# Altium schematic sheet Motor.schdoc
size A4
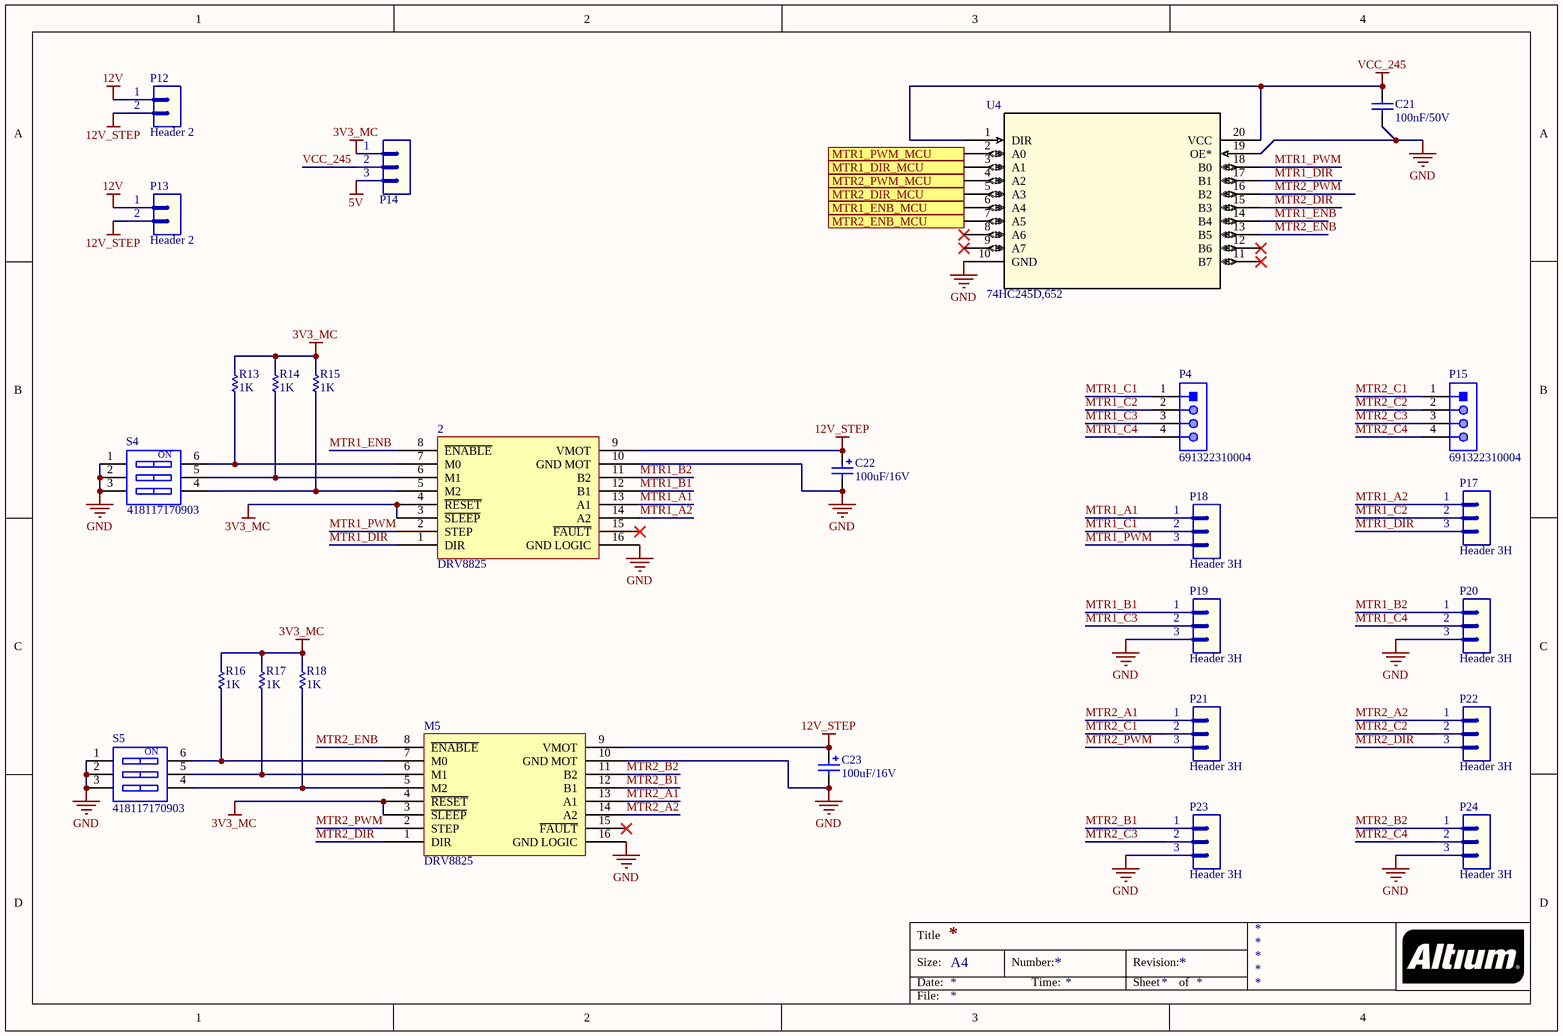
[diagram p0: Motor.schdoc]

## Parts
2  DRV8825  [PCBComponent_1]
C21  value 100nF/50V  [CAP-SM-0805]  (hidden comment: Cap-100nF-50V-0805)
C22  value 100uF/16V  [CAP-SM-AL-SIZE-D-D6L6]  (hidden comment: Cap-Al-100uF-16V-D6L5)
C23  value 100uF/16V  [CAP-SM-AL-SIZE-D-D6L6]  (hidden comment: Cap-Al-100uF-16V-D6L5)
M5  DRV8825  [PCBComponent_1]
P4  691322310004  [691322310004]
P12  Header 2  [JP2]
P13  Header 2  [JP2]
P14  Header 3  [JP3]  (value not drawn)
P15  691322310004  [691322310004]
P17  Header 3H  [JP3H]
P18  Header 3H  [JP3H]
P19  Header 3H  [JP3H]
P20  Header 3H  [JP3H]
P21  Header 3H  [JP3H]
P22  Header 3H  [JP3H]
P23  Header 3H  [JP3H]
P24  Header 3H  [JP3H]
R13  value 1K  [RES-SM-0805]  (hidden comment: Resistor 1/4W)
R14  value 1K  [RES-SM-0805]  (hidden comment: Resistor 1/4W)
R15  value 1K  [RES-SM-0805]  (hidden comment: Resistor 1/4W)
R16  value 1K  [RES-SM-0805]  (hidden comment: Resistor 1/4W)
R17  value 1K  [RES-SM-0805]  (hidden comment: Resistor 1/4W)
R18  value 1K  [RES-SM-0805]  (hidden comment: Resistor 1/4W)
S4  418117170903  [PCBComponent_1]
S5  418117170903  [PCBComponent_1]
U4  74HC245D,652  [SOT163-1_NEX]

## Ports
MTR1_DIR_MCU (in), MTR1_ENB_MCU (in), MTR1_PWM_MCU (in), MTR2_DIR_MCU (in), MTR2_ENB_MCU (in), MTR2_PWM_MCU (in)

## Nets
3V3_MC: 2.3(~{SLEEP}) 2.4(~{RESET}) M5.3(~{SLEEP}) M5.4(~{RESET}) P14.1 R13.2 R14.2 R15.2 R16.2 R17.2 R18.2
5V: P14.3
12V: P12.1 P13.1
12V_STEP: 2.9(VMOT) C22.1 C23.1 M5.9(VMOT) P12.2 P13.2
GND: 2.10(GND_MOT) 2.16(GND_LOGIC) C21.1 C22.2 C23.2 M5.10(GND_MOT) M5.16(GND_LOGIC) P19.3 P20.3 P23.3 P24.3 S4.1 S4.2 S4.3 S5.1 S5.2 S5.3 U4.10(GND) U4.19(OE*)
VCC_245: C21.2 P14.2 U4.1(DIR) U4.20(VCC)
MTR1_A1: 2.13(A1) P18.1
MTR1_A2: 2.14(A2) P17.1
MTR1_B1: 2.12(B1) P19.1
MTR1_B2: 2.11(B2) P20.1
MTR1_C1: P4.1 P18.2
MTR1_C2: P4.2 P17.2
MTR1_C3: P4.3 P19.2
MTR1_C4: P4.4 P20.2
MTR1_DIR: 2.1(DIR) P17.3 U4.17(B1)
MTR1_DIR_MCU: U4.3(A1) ; port MTR1_DIR_MCU
MTR1_ENB: 2.8(~{ENABLE}) U4.14(B4)
MTR1_ENB_MCU: U4.6(A4) ; port MTR1_ENB_MCU
MTR1_PWM: 2.2(STEP) P18.3 U4.18(B0)
MTR1_PWM_MCU: U4.2(A0) ; port MTR1_PWM_MCU
MTR2_A1: M5.13(A1) P21.1
MTR2_A2: M5.14(A2) P22.1
MTR2_B1: M5.12(B1) P23.1
MTR2_B2: M5.11(B2) P24.1
MTR2_C1: P15.1 P21.2
MTR2_C2: P15.2 P22.2
MTR2_C3: P15.3 P23.2
MTR2_C4: P15.4 P24.2
MTR2_DIR: M5.1(DIR) P22.3 U4.15(B3)
MTR2_DIR_MCU: U4.5(A3) ; port MTR2_DIR_MCU
MTR2_ENB: M5.8(~{ENABLE}) U4.13(B5)
MTR2_ENB_MCU: U4.7(A5) ; port MTR2_ENB_MCU
MTR2_PWM: M5.2(STEP) P21.3 U4.16(B2)
MTR2_PWM_MCU: U4.4(A2) ; port MTR2_PWM_MCU
Net2_5: 2.5(M2) R15.1 S4.4
Net2_6: 2.6(M1) R14.1 S4.5
Net2_7: 2.7(M0) R13.1 S4.6
NetM5_5: M5.5(M2) R18.1 S5.4
NetM5_6: M5.6(M1) R17.1 S5.5
NetM5_7: M5.7(M0) R16.1 S5.6

Not connected (* = marked no-connect by the designer): 2 15(~{FAULT})*; M5 15(~{FAULT})*; U4 8(A6)* 9(A7)* 11(B7)* 12(B6)*

## Notes on the sheet
- Title
- Size:
- Date:
- A4
- Number:
- Time:
- Revision:
- Sheet
- of
- File:
- (in symbol 418117170903) ON

## Library data of the parts
C21 = Cap-100nF-50V-0805: CAP CER 0.1UF 50V Y5V 0805; Manufacturer: Samsung Electro-Mechanics; Manufacturer Part Number: CL21F104ZBCNNNC; Local Supplier: thegioiic; Local Supplier Link: https://thegioiic.com/products/tu-100nf-0-1uf-50v-0805; Supplier 1: Digikey; Supplier 1 Part Number: 1276-1007-1-ND; Supplier 1 Link: https://www.digikey.com/product-detail/en/samsung-electro-mechanics/CL21F104ZBCNNNC/1276-1007-1-ND/3889093
C22 C23 = Cap-Al-100uF-16V-D6L5: CAP ALUM 100UF 20% 16V SMD; Manufacturer: Nichicon; Manufacturer Part Number: UWX1C101MCL1GB; Local Supplier: thegioiic; Local Supplier Link: https://thegioiic.com/products/tu-nhom-smd-100uf-16v-d6-3l5-4; Supplier 1: Digikey; Supplier 1 Part Number: 493-2105-1-ND; Supplier 1 Link: https://www.digikey.com/product-detail/en/nichicon/UWX1C101MCL1GB/493-2105-1-ND/590080
P4 P15 = 691322310004: WR-TBL Serie 322 Horizontal PCB Header, Pluggable, pitch 3.81mm, 4p; Compliance: RoHS; Modularity: No; Pin Number: 4; Rated Current [UL]: 10A; Working Voltage [UL]: 300VAC; ComponentLink1Description: Manufacturer; ComponentLink1URL: http://www.we-online.de; ComponentLink2URL: https://katalog.we-online.de/em/datasheet/691322310004.pdf; ComponentLink2Description: Datasheet; Mounting Technology: THT; Part Number: 691322310004; Packaging: Box; Operating Temperature: -40 to +105degC; PCB/Cable/Panel: PCB; Pitch: 3.81mm; Published Date: October 2019; Type: Horizontal; Publisher: Wurth Elektronik; Application: Pluggable
P12 P13 = Header 2: Header, 2-Pin; LatestRevisionDate: 17-Jul-2002; LatestRevisionNote: Re-released for DXP Platform.; Publisher: Altium Limited
P14 = Header 3: Header, 3-Pin; LatestRevisionDate: 17-Jul-2002; LatestRevisionNote: Re-released for DXP Platform.; Publisher: Altium Limited
P17-P24 = Header 3H: Header, 3-Pin, Right Angle; LatestRevisionDate: 17-Jul-2002; LatestRevisionNote: Re-released for DXP Platform.; Publisher: Altium Limited
R13-R18 = RES
S4 S5 = 418117170903: WS-DITV Compact THT Dip Switch, Flat Actuator, pitch 2.54mm, 3p; Operation Force: 800g; Pole Number: 3; Actuator Type: Flat Type; Circuit: SPST-NO; Rated Current Switching: 25mA; Rated Current Non-Switching: 100mA; Rated Voltage Non-Switching: 50VDC; Rated Voltage Switching: 24VDC; ComponentLink1Description: Manufacturer; ComponentLink1URL: http://www.we-online.de; ComponentLink2Description: Datasheet; ComponentLink2URL: https://katalog.we-online.com/em/datasheet/418117170903.pdf; Pitch: 2.54mm; Contact Material: Copper Alloy; Mounting Technology: THT; Operating Temperature: -40 to +85degC; Contact Plating: Gold; Packaging: Tube; Part Number: 418117170903; Publisher: Wurth Elektronik; Published Date: September 2019
U4 = 74HC245D,652: No Description Available; Vendor: Nexperia; SourceLibrary: Nexperia_2018-05-2018; Manufacturer_Part_Number: 74HC245D,652; Copyright: Copyright (C) 2016 Accelerated Designs. All rights reserved; RefDes: RefDes; Type: DEV